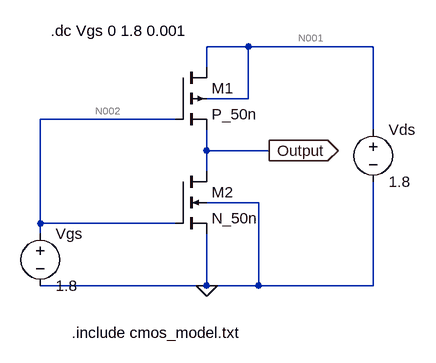
[diagram p0: schematic cmos inv.asc]
cmos inv.asc, the LTspice schematic file:
Version 4
SHEET 1 1040 4516
WIRE 256 0 192 0
WIRE 448 0 256 0
WIRE 192 32 192 0
WIRE 256 80 256 0
WIRE 256 80 192 80
WIRE 144 112 -64 112
WIRE 448 128 448 0
WIRE 192 160 192 128
WIRE 288 160 192 160
WIRE 192 192 192 160
WIRE 272 240 192 240
WIRE -64 272 -64 112
WIRE 144 272 -64 272
WIRE -64 288 -64 272
WIRE 192 368 192 288
WIRE 192 368 -64 368
WIRE 272 368 272 240
WIRE 272 368 192 368
WIRE 448 368 448 208
WIRE 448 368 272 368
FLAG 192 368 0
FLAG 288 160 Output
IOPIN 288 160 Out
SYMBOL nmos4 144 192 R0
SYMATTR InstName M2
SYMATTR Value N_50n
SYMATTR Value2 l=50n w=500n
SYMBOL pmos4 144 32 R0
SYMATTR InstName M1
SYMATTR Value P_50n
SYMATTR Value2 l=50n w=500n
SYMBOL voltage -64 272 R0
WINDOW 123 0 0 Left 0
WINDOW 39 0 0 Left 0
SYMATTR InstName Vgs
SYMATTR Value 1.8
SYMBOL voltage 448 112 R0
WINDOW 123 0 0 Left 0
WINDOW 39 0 0 Left 0
SYMATTR InstName Vds
SYMATTR Value 1.8
TEXT -48 -24 Left 2 !.dc Vgs 0 1.8 0.001
TEXT -16 440 Left 2 !.include cmos_model.txt

The netlist it stands for:
* cmos inv.asc
M2 Output N002 0 0 N_50n l=50n w=500n
M1 N001 N002 Output N001 P_50n l=50n w=500n
Vgs N002 0 1.8
Vds N001 0 1.8
.model NMOS NMOS
.model PMOS PMOS
.lib standard.mos
.dc Vgs 0 1.8 0.001
.include cmos_model.txt
.backanno
.end

* Results of the author's LTspice run, read from the files saved beside the schematic
* Operating Point, zero values left out:
*   V(output) = 1.8 V
*   V(n001) = 1.8 V
*   Id(M1) = 96.31 µA
*   Ig(M1) = -126.2 µA
*   Ib(M1) = 33.46 µA
*   Is(M1) = -3.542 µA
*   Id(M2) = 3.542 µA
*   Ig(M2) = -20.17 nA
*   Ib(M2) = -3.517 µA
*   Is(M2) = -5.465 nA
*   I(Vds) = -129.8 µA
*   I(Vgs) = 126.2 µA
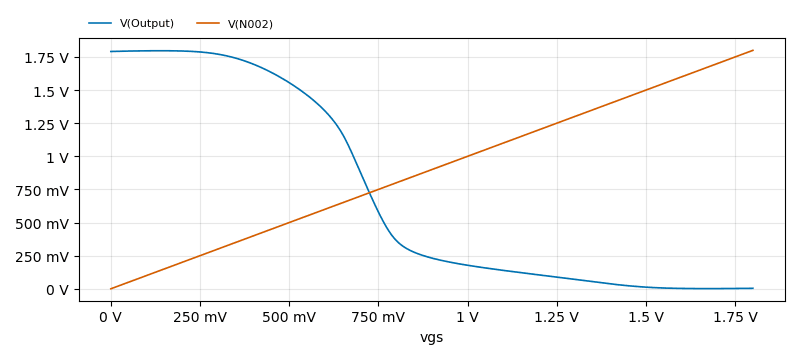
[diagram p1: DC transfer characteristic of cmos inv.asc, plotted from the saved traces]
* DC transfer characteristic, 1 run:
*   V(Output): 1.792 V at vgs=0 V, 3.618 mV at vgs=1.8 V, min 1.404 mV, max 1.797 V
*   V(N002): 0 V at vgs=0 V, 1.8 V at vgs=1.8 V, min 0 V, max 1.8 V